# EAGLE design EMS esp32 wifi v2.2 (EAGLE 9.5.2)
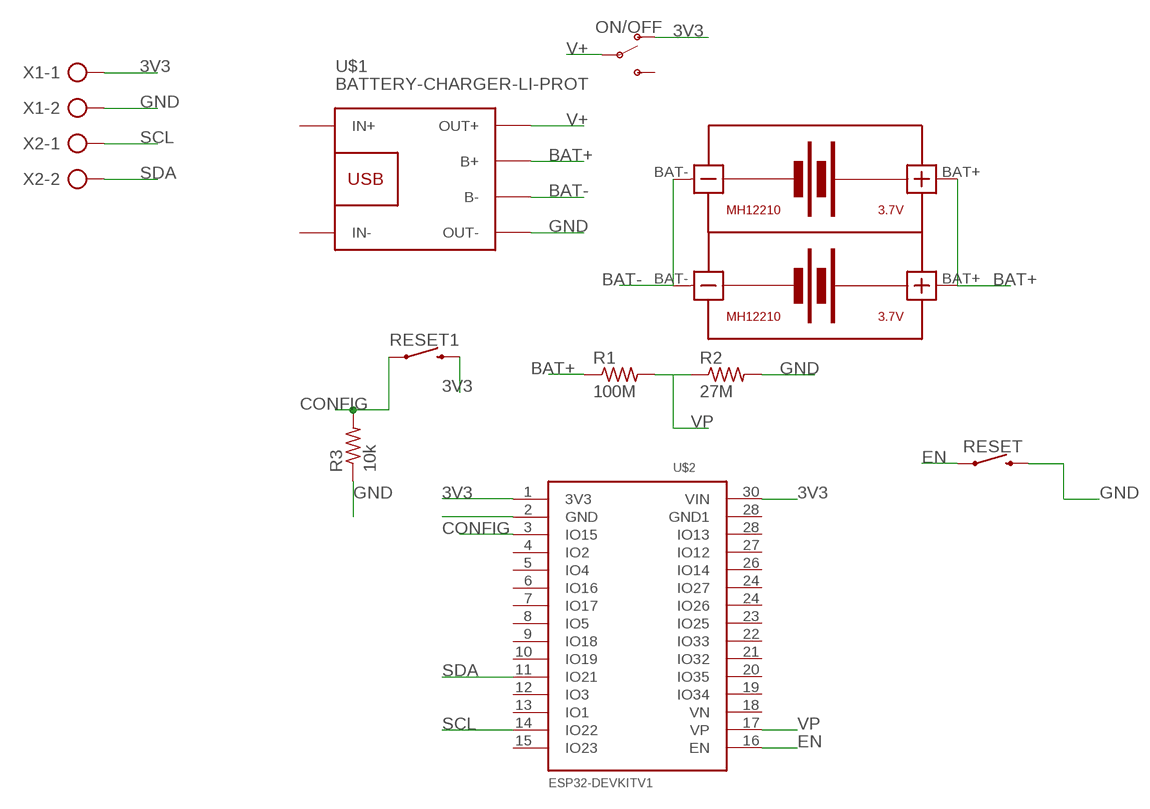
[diagram p0: schematic, sheet 1]

## Parts
ON/OFF  SWITCH-SPDT-PTH-11.6X4.0MM  [SWITCH_SPDT_PTH_11.6X4.0MM]
R1  100M  R-US_0204/7  [0204/7]
R2  27M  R-US_0204/7  [0204/7]
R3  10k  R-US_0204/7  [0204/7]
RESET  MOMENTARY-SWITCH-SPST-PTH-6.0MM  [TACTILE_SWITCH_PTH_6.0MM]
RESET1  MOMENTARY-SWITCH-SPST-PTH-6.0MM  [TACTILE_SWITCH_PTH_6.0MM]
U$1  BATTERY-CHARGER-LI-PROT  [BATTERY-CHARGER-LI-PROT]
U$2  ESP32DEVKITV1  [ESP32-DEVKITV1]
U$3  BATTERY-LI-MH12210  [BATTERY-LI-MH12210]
U$4  BATTERY-LI-MH12210  [BATTERY-LI-MH12210]
X1  AK500/2  [AK500/2]
X2  AK500/2  [AK500/2]

## Nets
3V3: ON/OFF.1(O) RESET1.3 U$2.1(3V3) U$2.30(VIN) X1.1
BAT+: R1.1 U$1.B+ U$3.BAT+ U$4.BAT+
BAT-: U$1.B- U$3.BAT- U$4.BAT-
CONFIG: R3.2 RESET1.1 U$2.3(IO15)
EN: RESET.1 U$2.16(EN)
GND: R2.2 R3.1 RESET.3 U$1.OUT- U$2.2(GND) X1.2
SCL: U$2.14(IO22) X2.1
SDA: U$2.11(IO21) X2.2
V+: ON/OFF.2(P) U$1.OUT+
VP: R1.2 R2.1 U$2.17(VP)
Unconnected: ON/OFF.3(S) U$1.IN+ U$1.IN- U$2.4(IO2) U$2.5(IO4) U$2.6(IO16) U$2.7(IO17) U$2.8(IO5) U$2.9(IO18) U$2.10(IO19) U$2.12(IO3) U$2.13(IO1) U$2.15(IO23) U$2.18(VN) U$2.19(IO34) U$2.20(IO35) U$2.21(IO32) U$2.22(IO33) U$2.23(IO25) U$2.24(IO26) U$2.24(IO27) U$2.26(IO14) U$2.27(IO12) U$2.28(GND1) U$2.28(IO13)

## Library data of the parts
ON/OFF = SparkFun-Switches:SWITCH-SPDT: Single Pole, Double Throw (SPDT) Switch Single-pole, double-throw (SPDT) switch. Variant Overview SMD-AYZ0202 Surface Mount DPDT Switch <https://www.sparkfun.com/products/597> (COM-00597) Used on e.g. LilyPad Arduino USB - ATmega32U4 Board <https://www.sparkfun.com/products/12049> PTH-11.6X4.0MM SPDT Mini Power Switch <https://www.sparkfun.com/products/102> (COM-00102) Used on e.g. SparkFun Simon Says - Through-Hole Soldering Kit <https://www.sparkfun.com/products/10547> (KIT-10547) PTH-11.6X4.0MM-KIT KIT version of SPDT Mini Power Switch - Simplifies soldering by removing tStop of switch pins - only one side can be soldered. PTH-11.6X4.0MM-LOCK LOCK version of SPDT Mini Power Switch - Offset pins hold switch in place for easier soldering. SMD-RIGHT-ANGLE Surface Mount Right Angle Switch <https://www.sparkfun.com/products/10860> (COM-10860) Used on e.g. SparkFun ESP8266 Thing <https://www.sparkfun.com/products/13231>; PROD_ID: SWCH-08261; SF_SKU: COM-00102
R1-R3 = rcl:R-US_: RESISTOR, American symbol; SPICEPREFIX: R
RESET RESET1 = SparkFun-Switches:MOMENTARY-SWITCH-SPST: Momentary Switch (Pushbutton) - SPST Normally-open (NO) SPST momentary switches (buttons, pushbuttons). Variants PTH-12MM - 12mm square, through-hole Momentary Pushbutton Switch - 12mm Square <https://www.sparkfun.com/products/9190> (COM-09190) PTH-6.0MM, PTH-6.0MM-KIT - 6.0mm square, through-hole Mini Pushbutton Switch <https://www.sparkfun.com/products/97> (COM-00097) KIT package intended for soldering kit's - only one side of pads' copper is exposed. PTH-RIGHT-ANGLE-KIT - Right-angle, through-hole Right Angle Tactile Button <https://www.sparkfun.com/products/10791> - Used on SparkFun BigTime Watch Kit <https://www.sparkfun.com/products/11734> SMD-12MM - 12mm square, surface-mount Tactile Button - SMD (12mm) <https://www.sparkfun.com/products/12993> (COM-12993) Used on SparkFun PicoBoard <https://www.sparkfun.com/products/11888> SMD-4.5MM - 4.5mm Square Trackball Switch Used on SparkFun Blackberry Trackballer Breakout <https://www.sparkfun.com/products/13169> SMD-4.6MMX2.8MM - 4.60mm x 2.80mm, surface mount Used on SparkFun SAMD21 Mini Breakout <https://www.sparkfun.com/products/13664> SMD-5.2MM, SMD-5.2-REDUNDANT - 5.2mm square, surface-mount Mini Pushbutton Switch - SMD <https://www.sparkfun.com/products/8720> (COM-08720) Used on Arduino Pro Mini <https://www.sparkfun.com/products/11114> REDUNDANT package connects both switch circuits together SMD-6.0X3.5MM - 6.0 x 3.5mm, surface mount Momentary Reset Switch SMD <https://www.sparkfun.com/products/8229> (COM-08229) SMD-6.2MM-TALL - 6.2mm square, surface mount Tactile Button - SMD (6mm) <https://www.sparkfun.com/products/12992> Used on SparkFun Digital Sandbox <https://www.sparkfun.com/products/12651> SMD-RIGHT-ANGLE - Right-angle, surface mount Used on SparkFun Block for Intel® Edison - Arduino <https://www.sparkfun.com/products/13036>; PROD_ID: SWCH-08441; SF_SKU: COM-00097
U$1 = diy-modules:BATTERY-CHARGER-LI-PROT: Lithium Battery 5V Charger with protection circuit More details available here: http://www.instructables.com/id/DIY-Lithium-ion-Battery-Charger/step4/TP4056-based-lithium-ion-battery-charger-module/ Click here to find device on ebay.com <http://www.ebay.com/sch/tp4056+charger+usb+protection>
U$2 = ESP32-DEVKITV1:ESP32DEVKITV1
U$3 U$4 = diy-modules:BATTERY-LI-MH12210: Lithium-Ion MH12210 Rechargeable Battery Panasonic NCR18650PF battery datasheet available here: https://industrial.panasonic.com/cdbs/www-data/pdf2/ACI4000/ACI4000C12.pdf Click here to find device on ebay.com <http://www.ebay.com/sch/ncr18650b+battery>
X1 X2 = con-ptr500:AK500/2: CONNECTOR; OC_FARNELL: unknown; OC_NEWARK: unknown

## Board
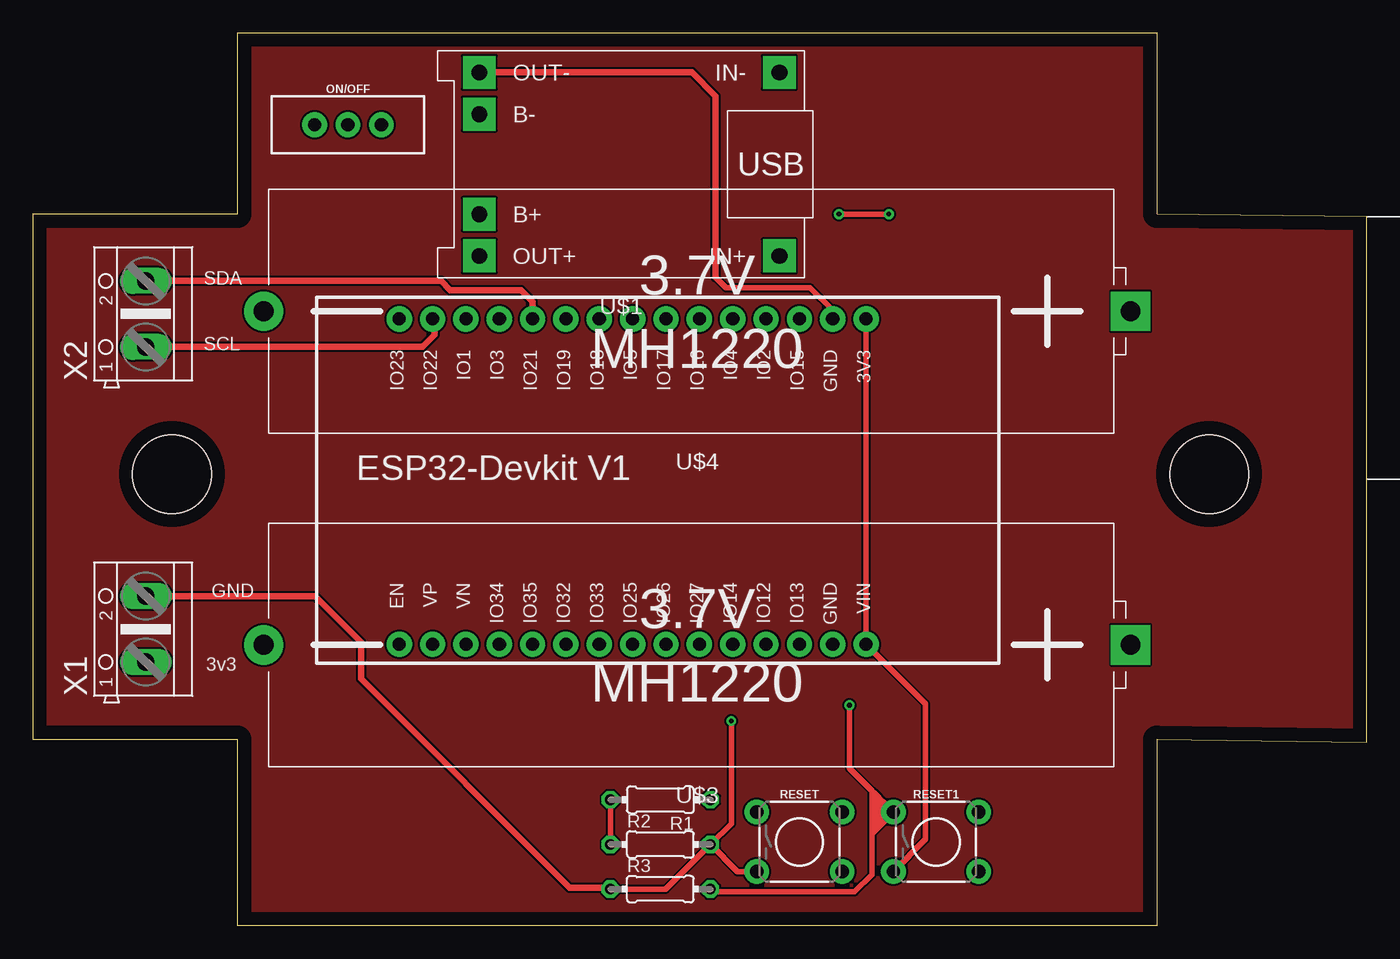
[diagram p1: board, top side]
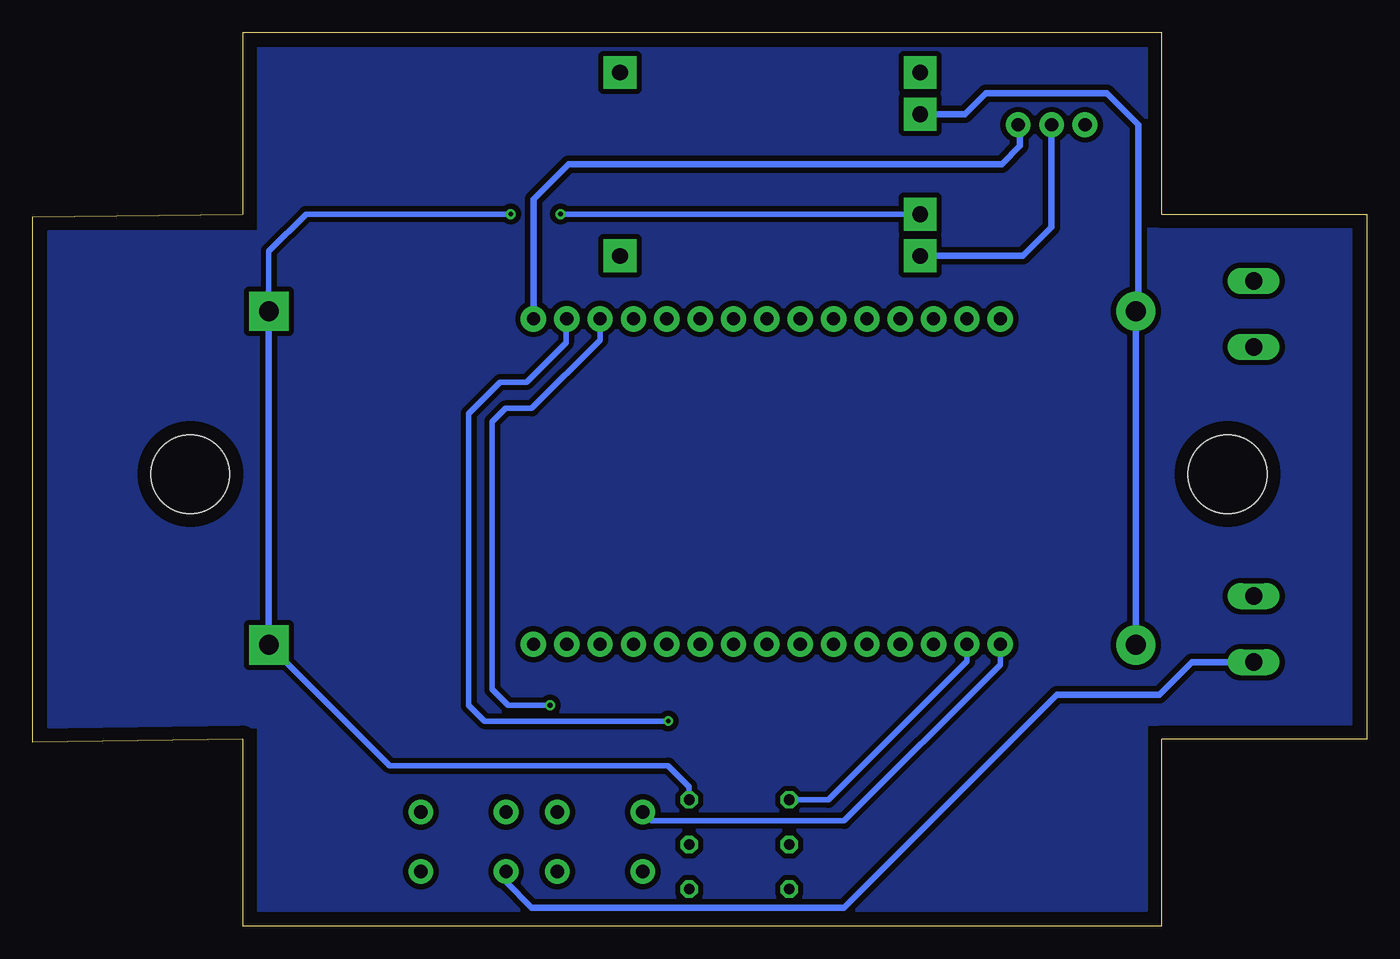
[diagram p2: board, bottom side, seen from below]

Size 101.6 x 68 mm. Coordinates in mm from the lower left corner, seen from the top.
Outline: 15.6,68 85.6,68 85.6,54.2 101.6,54 101.6,14 85.6,14.2 85.6,0 15.6,0 15.6,14.2 0,14.2 0,54.2 15.6,54.2 15.6,68
Copper layers (1*16): Top 0.035mm / dielectric 1.5mm / Bottom 0.035mm
Design rules "default": minimum track width 6mil, minimum drill 0.35mm, track to track 6mil, track to pad 6mil, pad to pad 6mil, via to via 6mil, smd to smd 6mil, copper to edge 40mil, drill to drill 6mil, minimum pad ring 10mil, minimum via ring 8mil, stop-mask expansion 4mil, vias tented up to drill 0mil, thermal gap 10mil
Holes 6 mm at 89.6,34.4 10.6,34.4

### Footprints (pad centres in the part's own frame; a part is rotated, then mirrored left to right if it is on the bottom)
SWITCH_SPDT_PTH_11.6X4.0MM = drill 1.016 pad 1.88: 1 0,2.54; 2 0,0; 3 0,-2.54
0204/7 = drill 0.813 octagon: 1 -3.81,0; 2 3.81,0
TACTILE_SWITCH_PTH_6.0MM = drill 1.016 pad 1.88: 1 -3.251,2.261; 2 3.251,2.261; 3 -3.251,-2.261; 4 3.251,-2.261
BATTERY-CHARGER-LI-PROT = drill 1.2 pad 2.5 square: B+ 10.795,3.81; B- 10.795,-3.81; IN+ -12.065,6.985; IN- -12.065,-6.985; OUT+ 10.795,6.985; OUT- 10.795,-6.985
ESP32-DEVKITV1 = drill 1 pad 1.93: 1 -22.87,-13.54; 2 -20.33,-13.54; 3 -17.79,-13.54; 4 -15.25,-13.54; 5 -12.71,-13.54; 6 -10.17,-13.54; 7 -7.63,-13.54; 8 -5.09,-13.54; 9 -2.55,-13.54; 10 -0.01,-13.54; 11 2.53,-13.54; 12 5.07,-13.54; 13 7.61,-13.54; 14 10.15,-13.54; 15 12.69,-13.54; 16 12.69,11.23; 17 10.15,11.23; 18 7.61,11.23; 19 5.07,11.23; 20 2.53,11.23; 21 -0.01,11.23; 22 -2.55,11.23; 23 -5.09,11.23; 24 -7.63,11.23; 25 -10.17,11.23; 26 -12.71,11.23; 27 -15.25,11.23; 28 -17.79,11.23; 29 -20.33,11.23; 30 -22.87,11.23
BATTERY-LI-MH12210 = drill 1.5 pad 3 square: BAT+ -33.02,0 | drill 1.5 pad 3: BAT- 33.02,0
AK500/2 = drill 1.321 long: 1 -2.515,0; 2 2.515,0

### Placement (x,y rotation side)
ON/OFF  24,61 270 top
R1  47.8,9.6 180 top
R2  47.8,6.2 0 top
R3  47.8,2.8 0 top
RESET  58.4,6.4 0 top
RESET1  68.8,6.4 0 top
U$1  44.8,58 180 top
U$2  40.6,32.68 180 top
U$3  50.6,21.4 180 top
U$4  50.6,46.8 180 top
X1  8.6,22.6 90 top
X2  8.6,46.6 90 top

### Tracks (layer width: path | path; a pad name or v marks a point on that pad's centre or on a via)
3V3
  Top 0.406: U$2.1 U$2.30 68,16.92 68,6.59 RESET1.3
  Bottom 0.508: U$2.1 63.47,55.33 60.8,58 27.8,58 26.4,59.4 26.4,60.86 ON/OFF.1 | X1.1 13.31,20.08 15.8,17.6 23.6,17.6 39.8,1.4 63.6,1.4 65.55,3.35 RESET1.3
B
  pour Bottom (isolate 0.406): 1.2,53 16.8,53 16.8,66.8 84.4,66.8 84.4,52.8 100.4,52.8 100.4,15.2 84.4,15.2 84.4,1.2 16.8,1.2 16.8,15.4 1.2,15.4
BAT+  (via drill 0.35)
  Top 0.152: 83.71,46.79 U$4.BAT+ | 83.71,21.5 U$3.BAT+
  Top 0.406: v61.4,54.2 v65.2,54.2
  Bottom 0.152: 51.71,9.61 R1.1 | 83.56,21.34 U$3.BAT+ | 34.49,54.11 34.03,54.11 U$1.B+
  Bottom 0.406: U$3.BAT+ 74.42,12.2 53.2,12.2 51.61,10.61 R1.1 | U$1.B+ v61.39,54.19 v61.4,54.2 | v65.2,54.2 80.8,54.2 83.62,51.38 U$4.BAT+
  Bottom 0.508: U$4.BAT+ U$3.BAT+
BAT-
  Bottom 0.152: 17.57,46.95 U$4.BAT- 17.72,46.95 | 33.88,61.73 U$1.B-
  Bottom 0.508: U$1.B- 30.59,61.81 29,63.4 19.8,63.4 17.4,61 17.4,46.98 U$4.BAT- U$3.BAT-
CONFIG  (via drill 0.35)
  Top 0.152: 64.36,8.54 63.91,8.09 | 64.36,8.54 65,8.54 65.43,8.54 RESET1.1 | 51.71,2.9 R3.2 | 64.36,8.54 64.25,8.65
  Top 0.406: RESET1.1 64.48,8.66 63.91,8.09 | 63.91,7.02 63.91,3.91 62.6,2.6 51.81,2.6 R3.2 | 63.91,7.02 63.91,7.6 | 63.91,7.6 63.91,7.8 | 63.91,7.8 63.91,8.09 | RESET1.1 65.31,8.91 | 65.31,8.91 64.71,9.5 | 64.71,9.5 64.21,10 | 64.21,10 63.91,10.3 | 63.91,8.09 63.91,10.3 | 64.21,10 64.21,9 | 64.21,9 64.21,8.7 64.25,8.65 | 64.71,9.5 64.5,9.3 | 64.5,9.3 64.21,9 | RESET1.1 63.91,7.02 | 64.5,9.3 64.5,9 | 64.5,9 64.5,8.39 63.91,7.8 | 63.91,7.6 64.85,8.54 65,8.54 | RESET1.1 64.84,8.66 64.5,9 | 64.5,9.3 64.9,8.91 65.31,8.91 | v62.2,16.8 62.2,12.01 63.91,10.3
  Bottom 0.152: 51.48,2.85 R3.2 | 57.65,46.18 58.26,46.18 U$2.3
  Bottom 0.406: U$2.3 58.39,44.61 63.6,39.4 65.6,39.4 66.6,38.4 66.6,18 65.4,16.8 v62.2,16.8
EN
  Bottom 0.406: U$2.16 27.91,19.89 39.8,8 54.49,8 RESET.1
GND  (via drill 0.35)
  Top 0.152: R3.1 44.09,2.9 48.36,2.9 51.56,6.1 R2.2 | 60.09,46.34 60.85,46.34 U$2.2 | 52.02,49.2 52.02,49.38
  Top 0.406: R2.2 53.2,7.79 v53.2,15.6 | R2.2 48.21,2.8 R3.1 | RESET.3 53.67,4.14 R2.2 | 52.02,49.38 52.8,48.6 59.2,48.6 60.93,46.87 U$2.2
  Top 0.508: X1.2 21.49,25.11 25,21.6 25,18.8 40.9,2.9 44.09,2.9 | U$1.OUT- 50.22,64.98 52.02,63.19 52.02,49.38
  Bottom 0.406: U$2.2 61,46.15 61,44.4 64,41.4 66,41.4 68.4,39 68.4,16.8 67.2,15.6 v53.2,15.6
SCL
  Top 0.508: X2.1 29.69,44.08 30.6,45 30.6,46.07 U$2.14
  Bottom 0.152: 30.58,46.16 U$2.14
SDA
  Top 0.508: X2.2 31.09,49.11 31.8,48.4 37.2,48.4 38.07,47.53 U$2.11
  Bottom 0.152: 38.2,46.16 U$2.11
T
  pour Top: 16.6,67.8 85,67.8 85,53.6 101.2,53.6 101.2,14.6 100.2,14.6 85.2,14.6 85.2,0.6 16.2,0.6 16.2,14.6 0.6,14.6 0.6,53.4 0.6,53.6 16,53.6 16,67.8
V+
  Bottom 0.508: ON/OFF.2 24,53.2 26.19,51.02 U$1.OUT+
VP
  Top 0.152: 44.01,6.05 R2.1 44.09,6.26
  Top 0.406: R1.2 43.99,6.36 44.09,6.26
  Bottom 0.406: U$2.17 30.45,20.15 41,9.6 R1.2

### Text on the board
tPlace: SDA | SCL | GND | 3v3